# EAGLE design Linetrackerboard_v2 (EAGLE 9.6.2)
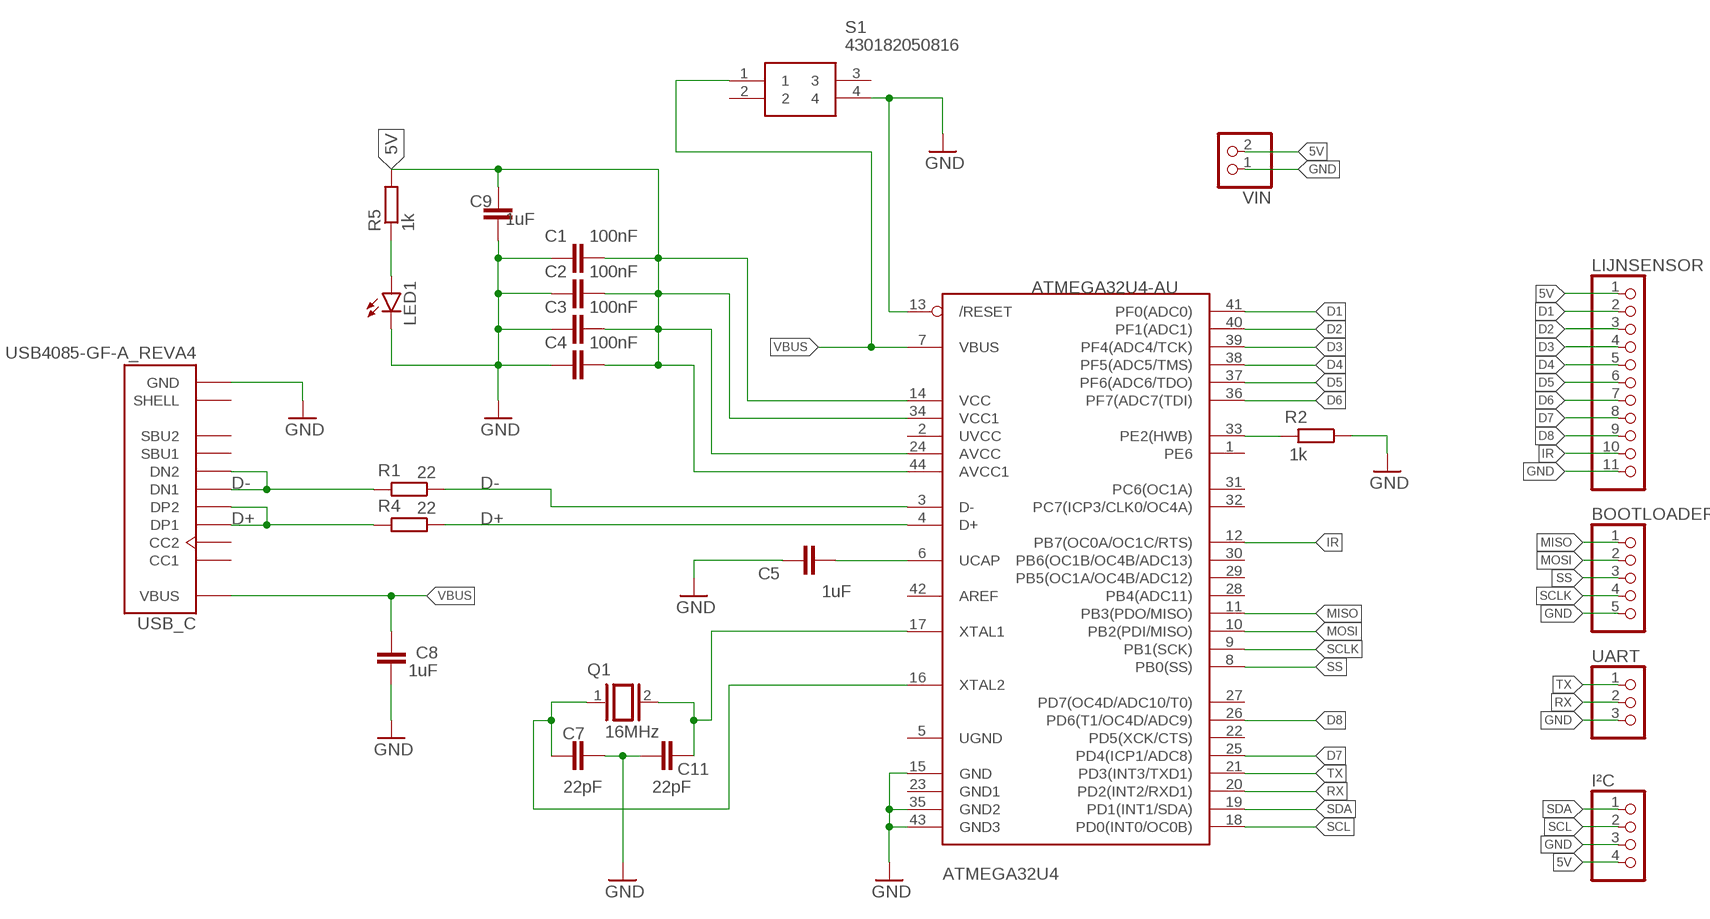
[diagram p0: schematic, sheet 1]

## Parts
ATMEGA32U4  ATMEGA32U4-AU  [TQFP44]
BOOTLOADER  PINHD-1X5  [1X05]
C1  100nF  C-EUC0805  [C0805]
C2  100nF  C-EUC0805  [C0805]
C3  100nF  C-EUC0805  [C0805]
C4  100nF  C-EUC0805  [C0805]
C5  1uF  C-EUC0805  [C0805]
C7  22pF  C-EUC0805  [C0805]
C8  1uF  C-EUC0603  [C0603]
C9  1uF  C-EUC0603  [C0603]
C11  22pF  C-EUC0805  [C0805]
I²C  PINHD-1X4  [1X04]
LED1  LED  [SMARTLED-TTW]
LIJNSENSOR  PINHD-1X11  [1X11]
Q1  16MHz  XTAL/S  [QS]
R1  22  R-EU_M0805  [M0805]
R2  1k  R-EU_M0805  [M0805]
R4  22  R-EU_M0805  [M0805]
R5  1k  R-EU_M0805  [M0805]
S1  430182050816  [430182070816]
UART  PINHD-1X3  [1X03]
USB_C  USB4085-GF-A_REVA4  [GCT_USB4085-GF-A_REVA4]
VIN  PINHD-1X2  [1X02]

## Nets
5V: ATMEGA32U4.14(VCC) ATMEGA32U4.24(AVCC) ATMEGA32U4.34(VCC1) ATMEGA32U4.44(AVCC1) C1.2 C2.2 C3.2 C4.2 C9.2 I²C.4 LIJNSENSOR.1 R5.2 VIN.2
D1: ATMEGA32U4.41(PF0(ADC0)) LIJNSENSOR.2
D2: ATMEGA32U4.40(PF1(ADC1)) LIJNSENSOR.3
D3: ATMEGA32U4.39(PF4(ADC4/TCK)) LIJNSENSOR.4
D4: ATMEGA32U4.38(PF5(ADC5/TMS)) LIJNSENSOR.5
D5: ATMEGA32U4.37(PF6(ADC6/TDO)) LIJNSENSOR.6
D6: ATMEGA32U4.36(PF7(ADC7(TDI)) LIJNSENSOR.7
D7: ATMEGA32U4.25(PD4(ICP1/ADC8)) LIJNSENSOR.8
D8: ATMEGA32U4.26(PD6(T1/OC4D/ADC9)) LIJNSENSOR.9
D+: ATMEGA32U4.4(D+) R4.1 R4.2 USB_C.A6(DP1) USB_C.B6(DP2)
D-: ATMEGA32U4.3(D-) R1.1 R1.2 USB_C.A7(DN1) USB_C.B7(DN2)
GND: ATMEGA32U4.13(/RESET) ATMEGA32U4.15(GND) ATMEGA32U4.35(GND2) ATMEGA32U4.43(GND3) BOOTLOADER.5 C1.1 C2.1 C3.1 C4.1 C5.1 C7.2 C8.2 C9.1 C11.1 I²C.3 LED1.C@1(C) LIJNSENSOR.11 R2.1 S1.4 UART.3 USB_C.A1(GND) USB_C.A12(GND) USB_C.B1(GND) USB_C.B12(GND) VIN.1
IR: ATMEGA32U4.12(PB7(OC0A/OC1C/RTS)) LIJNSENSOR.10
MISO: ATMEGA32U4.11(PB3(PDO/MISO)) BOOTLOADER.1
MOSI: ATMEGA32U4.10(PB2(PDI/MISO)) BOOTLOADER.2
N$4: LED1.A@1(A) R5.1
PE2: ATMEGA32U4.33(PE2(HWB)) R2.2
RX: ATMEGA32U4.20(PD2(INT2/RXD1)) UART.2
SCL: ATMEGA32U4.18(PD0(INT0/OC0B)) I²C.2
SCLK: ATMEGA32U4.9(PB1(SCK)) BOOTLOADER.4
SDA: ATMEGA32U4.19(PD1(INT1/SDA)) I²C.1
SS: ATMEGA32U4.8(PB0(SS)) BOOTLOADER.3
TX: ATMEGA32U4.21(PD3(INT3/TXD1)) UART.1
UCAP: ATMEGA32U4.6(UCAP) C5.2
VBUS: ATMEGA32U4.7(VBUS) C8.1 S1.1 USB_C.A4(VBUS) USB_C.A9(VBUS) USB_C.B4(VBUS) USB_C.B9(VBUS)
XTAL1: ATMEGA32U4.17(XTAL1) C11.2 Q1.2
XTAL2: ATMEGA32U4.16(XTAL2) C7.1 Q1.1
Unconnected: ATMEGA32U4.1(PE6) ATMEGA32U4.2(UVCC) ATMEGA32U4.5(UGND) ATMEGA32U4.22(PD5(XCK/CTS)) ATMEGA32U4.23(GND1) ATMEGA32U4.27(PD7(OC4D/ADC10/T0)) ATMEGA32U4.28(PB4(ADC11)) ATMEGA32U4.29(PB5(OC1A/OC4B/ADC12)) ATMEGA32U4.30(PB6(OC1B/OC4B/ADC13)) ATMEGA32U4.31(PC6(OC1A)) ATMEGA32U4.32(PC7(ICP3/CLK0/OC4A)) ATMEGA32U4.42(AREF) S1.2 S1.3 USB_C.A5(CC1) USB_C.A8(SBU1) USB_C.B5(CC2) USB_C.B8(SBU2) USB_C.P1(SHELL) USB_C.P2(SHELL) USB_C.P3(SHELL) USB_C.P4(SHELL)

## Library data of the parts
ATMEGA32U4 = adaprog:ATMEGA32U4
BOOTLOADER = pinhead:PINHD-1X5: PIN HEADER
C1-C5 C7-C9 C11 = rcl:C-EU: CAPACITOR, European symbol; SPICEPREFIX: C
I²C = pinhead:PINHD-1X4: PIN HEADER
LED1 = led:LED: LED OSRAM: - CHIPLED LG R971, LG N971, LY N971, LG Q971, LY Q971, LO R971, LY R971 LH N974, LH R974 LS Q976, LO Q976, LY Q976 LO Q996 - Hyper CHIPLED LW Q18S LB Q993, LB Q99A, LB R99A - SideLED LS A670, LO A670, LY A670, LG A670, LP A670 LB A673, LV A673, LT A673, LW A673 LH A674 LY A675 LS A676, LA A676, LO A676, LY A676, LW A676 LS A679, LY A679, LG A679 - Hyper Micro SIDELED® LS Y876, LA Y876, LO Y876, LY Y876 LT Y87S - SmartLED LW L88C, LW L88S LB L89C, LB L89S, LG L890 LS L89K, LO L89K, LY L89K LS L896, LA L896, LO L896, LY L896 - TOPLED LS T670, LO T670, LY T670, LG T670, LP T670 LSG T670, LSP T670, LSY T670, LOP T670, LYG T670 LG T671, LOG T671, LSG T671 LB T673, LV T673, LT T673, LW T673 LH T674 LS T676, LA T676, LO T676, LY T676, LB T676, LH T676, LSB T676, LW T676 LB T67C, LV T67C, LT T67C, LS T67K, LO T67K, LY T67K, LW E67C LS E67B, LA E67B, LO E67B, LY E67B, LB E67C, LV E67C, LT E67C LW T67C LS T679, LY T679, LG T679 LS T770, LO T770, LY T770, LG T770, LP T770 LB T773, LV T773, LT T773, LW T773 LH T774 LS E675, LA E675, LY E675, LS T675 LS T776, LA T776, LO T776, LY T776, LB T776 LHGB T686 LT T68C, LB T68C - Hyper Mini TOPLED® LB M676 - Mini TOPLED Santana® LG M470 LS M47K, LO M47K, LY M47K Source: http://www.osram.convergy.de LUXEON: - LUMILED® LXK2-PW12-R00, LXK2-PW12-S00, LXK2-PW14-U00, LXK2-PW14-V00 LXK2-PM12-R00, LXK2-PM12-S00, LXK2-PM14-U00 LXK2-PE12-Q00, LXK2-PE12-R00, LXK2-PE12-S00, LXK2-PE14-T00, LXK2-PE14-U00 LXK2-PB12-K00, LXK2-PB12-L00, LXK2-PB12-M00, LXK2-PB14-N00, LXK2-PB14-P00, LXK2-PB14-Q00 LXK2-PR12-L00, LXK2-PR12-M00, LXK2-PR14-Q00, LXK2-PR14-R00 LXK2-PD12-Q00, LXK2-PD12-R00, LXK2-PD12-S00 LXK2-PH12-R00, LXK2-PH12-S00 LXK2-PL12-P00, LXK2-PL12-Q00, LXK2-PL12-R00 Source: www.luxeon.com KINGBRIGHT: KA-3528ASYC Source: www.kingbright.com
LIJNSENSOR = pinhead:PINHD-1X11: PIN HEADER
Q1 = special:XTAL/S: CRYSTAL
R1 R2 R4 R5 = rcl:R-EU_: RESISTOR, European symbol; SPICEPREFIX: R
S1 = push button:430182050816: Black Tactile Tactile Switch, NO 50 mA 1.6mm Surface Mount Source: Datasheet <http://katalog.we-online.de/em/datasheet/4301x2xxx8x6.pdf>; DESCRIPTION: Black Tactile Tactile Switch, NO 50 mA 1.6mm Surface Mount; HEIGHT: mm; MANUFACTURER_NAME: Wurth Elektronik; MANUFACTURER_PART_NUMBER: 430182050816; MOUSER_PART_NUMBER: 710-430182050816; MOUSER_PRICE-STOCK: https://www.mouser.co.uk/ProductDetail/Wurth-Elektronik/430182050816?qs=wr8lucFkNMUyle0jQPgWGw%3D%3D
UART = pinhead:PINHD-1X3: PIN HEADER
USB_C = USB4085-GF-A:USB4085-GF-A_REVA4: USB 2.0 Type C Receptacle Dip Type, PCB Top Mount Check availability <https://pricing.snapeda.com/parts/USB4085-GF-A/Global%20Connector%20Technology/view-part?ref=eda>; AVAILABILITY: In Stock; DESCRIPTION: USB-C (USB TYPE-C) USB 2.0 Receptacle Connector 24 (16+8 Dummy) Position Through Hole, Right Angle, low cost, 3.46mm profile, 16 pin, horizontal, Top mount; MF: Global Connector Technology; MP: USB4085-GF-A; PACKAGE: None; PRICE: None; PURCHASE-URL: https://pricing.snapeda.com/search/part/USB4085-GF-A/?ref=eda
VIN = pinhead:PINHD-1X2: PIN HEADER

## Board
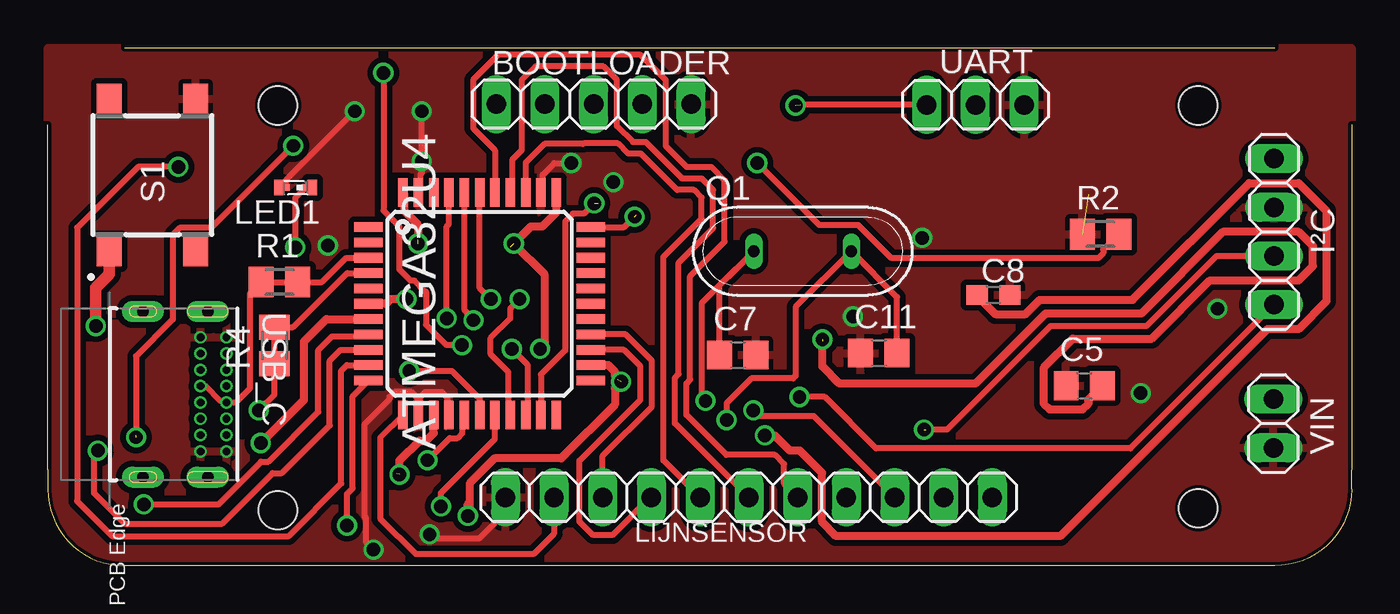
[diagram p1: board, top side]
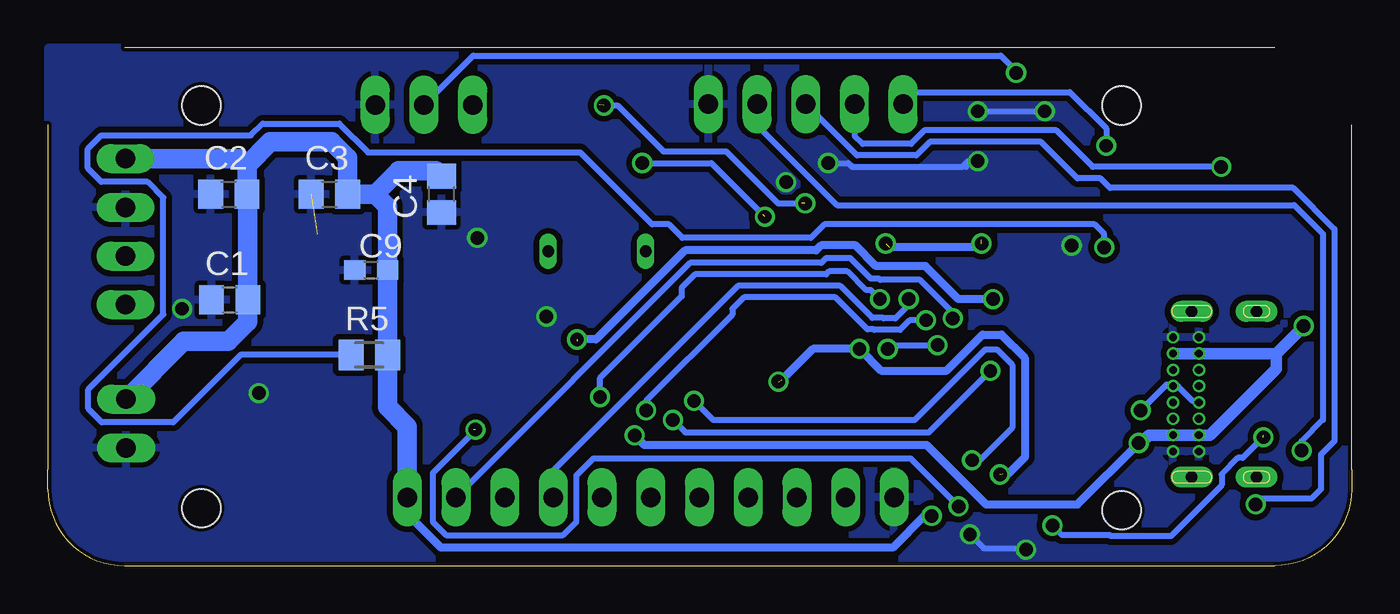
[diagram p2: board, bottom side, seen from below]

Size 68 x 27 mm. Coordinates in mm from the lower left corner, seen from the top.
Outline: 4,27 64,27
Outline: 68,23 68,5 68,4 arc-90 64,0 4,0 arc-90 0,4 0,5 0,23
Copper layers (1*16): Top 0.035mm / dielectric 1.5mm / Bottom 0.035mm
Design rules "default *": minimum track width 0.3mm, minimum drill 0.35mm, track to track 0.3mm, track to pad 0.3mm, pad to pad 0.2mm, via to via 0.3mm, smd to smd 0.2mm, copper to edge 0.2mm, drill to drill 0.3mm, minimum pad ring 0.1mm, minimum via ring 0.1mm, stop-mask expansion 4mil, vias tented up to drill 0mil, thermal gap 10mil
Holes 2 mm at 12,24 60,24 60,3 12,2.9

### Footprints (pad centres in the part's own frame; a part is rotated, then mirrored left to right if it is on the bottom)
TQFP44 = smd 1.5 x 0.5: 1 -5.8,4; 2 -5.8,3.2; 3 -5.8,2.4; 4 -5.8,1.6; 5 -5.8,0.8; 6 -5.8,0; 7 -5.8,-0.8; 8 -5.8,-1.6; 9 -5.8,-2.4; 10 -5.8,-3.2; 11 -5.8,-4; 23 5.8,-4; 24 5.8,-3.2; 25 5.8,-2.4; 26 5.8,-1.6; 27 5.8,-0.8; 28 5.8,0; 29 5.8,0.8; 30 5.8,1.6; 31 5.8,2.4; 32 5.8,3.2; 33 5.8,4 | smd 0.5 x 1.5: 12 -4,-5.8; 13 -3.2,-5.8; 14 -2.4,-5.8; 15 -1.6,-5.8; 16 -0.8,-5.8; 17 0,-5.8; 18 0.8,-5.8; 19 1.6,-5.8; 20 2.4,-5.8; 21 3.2,-5.8; 22 4,-5.8; 34 4,5.8; 35 3.2,5.8; 36 2.4,5.8; 37 1.6,5.8; 38 0.8,5.8; 39 0,5.8; 40 -0.8,5.8; 41 -1.6,5.8; 42 -2.4,5.8; 43 -3.2,5.8; 44 -4,5.8
1X05 = drill 1.016 long: 1 -5.08,0; 2 -2.54,0; 3 0,0; 4 2.54,0; 5 5.08,0
C0805 = smd 1.3 x 1.5: 1 -0.95,0; 2 0.95,0
C0603 = smd 1.1 x 1: 1 -0.85,0; 2 0.85,0
1X04 = drill 1.016 long: 1 -3.81,0; 2 -1.27,0; 3 1.27,0; 4 3.81,0
SMARTLED-TTW = smd 0.8 x 0.5: A 0,-0.875; C 0,0.875 | smd 0.35 x 0.35: A@1 0,-0.5; C@1 0,0.5
1X11 = drill 1.016 long: 1 -12.7,0; 2 -10.16,0; 3 -7.62,0; 4 -5.08,0; 5 -2.54,0; 6 0,0; 7 2.54,0; 8 5.08,0; 9 7.62,0; 10 10.16,0; 11 12.7,0
QS = drill 0.61 long: 1 -2.54,0; 2 2.54,0
M0805 = smd 1.3 x 1.6: 1 -0.95,0; 2 0.95,0
430182070816 = smd 1.55 x 1.3: 1 -3.975,2.25; 2 -3.975,-2.25; 3 3.975,2.25; 4 3.975,-2.25
1X03 = drill 1.016 long: 1 -2.54,0; 2 0,0; 3 2.54,0
GCT_USB4085-GF-A_REVA4 = drill 0.4 pad 0.65: A1 -2.975,4.025; A4 -2.125,4.025; A5 -1.275,4.025; A6 -0.425,4.025; A7 0.425,4.025; A8 1.275,4.025; A9 2.125,4.025; A12 2.975,4.025; B1 2.975,2.675; B4 2.125,2.675; B5 1.275,2.675; B6 0.425,2.675; B7 -0.425,2.675; B8 -1.275,2.675; B9 -2.125,2.675; B12 -2.975,2.675 | drill 0.6 pad 1.108 long: P1 -4.325,3.045; P2 4.325,3.045; P3 4.325,-0.335; P4 -4.325,-0.335
1X02 = drill 1.016 long: 1 -1.27,0; 2 1.27,0

### Placement (x,y rotation side)
ATMEGA32U4  22.52,13.66 0 top
BOOTLOADER  28.47,24.07 0 top
C1  58.52,13.87 0 bottom
C2  58.57,19.37 0 bottom
C3  53.32,19.37 0 bottom
C4  47.47,19.37 90 bottom
C5  54.06,9.39 0 top
C7  35.99,10.99 0 top
C8  49.32,14.12 0 top
C9  51.14,15.42 0 bottom
C11  43.34,11.09 0 top
I²C  63.95,17.42 90 top
LED1  12.93,19.72 90 top
LIJNSENSOR  36.56,3.57 180 top
Q1  39.36,16.4 0 top
R1  12.08,14.79 0 top
R2  54.9,17.29 0 top
R4  11.82,11.49 90 top
R5  51.24,10.99 0 bottom
S1  5.45,20.37 90 top
UART  48.39,24.04 0 top
USB_C  5.29,8.94 270 top
VIN  63.92,7.42 90 top

### Tracks (layer width: path | path; a pad name or v marks a point on that pad's centre or on a via)
5V  (via drill 0.7 pad 0.95)  (4 unrouted)
  Top 0.406: ATMEGA32U4.44 18.57,19.41 18.57,18.5 19.3,17.77 19.3,17 | ATMEGA32U4.34 26.52,18.42 25.8,17.7 25.2,17.7 v24.3,16.8 25.9,15.2 25.9,11.54 v25.67,11.31 | ATMEGA32U4.24 29.23,10.46 29.57,10.12 29.57,9.93 v29.9,9.6 29.57,9.27 29.57,8.4 26.77,5.6 23.3,5.6 22,4.3 22,3.3 | v18.34,4.76 18.34,5.49 19.37,6.53 19.73,6.53 20.12,6.92 ATMEGA32U4.14 | 22,3.3 22,3.1 | v21.9,2.6 21.9,3.2 22,3.3
  Bottom 0.406: v19.3,16.8 19.5,16.6 24.1,16.6 | 29.7,9.7 28.09,11.31 v25.67,11.31 24.54,10.18 21.12,10.18 19.25,12.05 18.25,12.05 17.05,10.84 17.05,5.65 17.9,4.8 18.2,4.8 | v21.9,2.6 22.28,2.6 23.94,0.94 47.49,0.94 49.26,2.71 LIJNSENSOR.1
  Bottom 1.016: VIN.2 60.91,11.7 58.6,11.7 57.57,12.73 C1.2 57.57,19.32 C2.2 57.62,20.88 | 57.62,20.88 56.4,22.1 53.2,22.1 52.37,21.27 C3.2 50.93,19.37 | 50.93,19.37 49.7,20.6 47.75,20.6 C4.2 | 50.93,19.37 50.29,18.73 C9.2 R5.2 50.29,8.29 49.26,7.26 LIJNSENSOR.1 | I²C.4 57.97,21.23 57.62,20.88
D1  (via drill 0.7 pad 0.95)
  Top 0.3: v20.8,12.9 20.8,17.7 20.92,17.82 ATMEGA32U4.41
  Bottom 0.3: v20.8,12.9 20.8,13.2 22.51,14.91 24.6,14.91 24.66,14.97 25.07,14.97 26.14,16.05 27.41,16.05 27.66,15.79 34.5,15.79 LIJNSENSOR.2
D2  (via drill 0.7 pad 0.95)
  Top 0.3: LIJNSENSOR.3 39.95,7.8 37.1,7.8 v36.8,8.1 | v22.2,12.8 22,12.8 21.88,12.93 21.88,13.2 21.72,13.36 ATMEGA32U4.40
  Bottom 0.3: v36.8,8.1 36.8,8.6 32.3,13.1 32.3,13.39 31.7,13.99 26.92,13.99 25.25,12.32 24.93,12.32 24.9,12.3 23.55,12.3 23.05,12.8 v22.2,12.8
D3  (via drill 0.7 pad 0.95)
  Top 0.3: v23.1,13.9 22.52,14.48 ATMEGA32U4.39
  Bottom 0.3: LIJNSENSOR.4 41.64,4.96 32.01,14.59 26.67,14.59 25,12.93 24.43,12.93 24.4,12.9 23.8,12.9 23.1,13.6 v23.1,13.9
D4
  Top 0.3: ATMEGA32U4.38 23.32,21.66 22.18,22.81 22.18,25.33 23.49,26.64 30.91,26.64 32.22,25.33 32.22,21.9 33.32,20.8 34.6,20.8 35.3,20.1 35.3,16.9 33.5,15.1 33.5,9.7 33.3,9.5 33.3,7.87 35.38,5.79 37.91,5.79 38.4,5.3 38.4,4.27 LIJNSENSOR.5
D5
  Top 0.3: LIJNSENSOR.6 32.7,7.43 32.7,9.8 32.9,10 32.9,15.8 34.7,17.6 34.7,19.6 34.1,20.2 33.07,20.2 31.18,22.1 30.51,22.1 29.68,22.92 29.68,25.33 28.97,26.04 25.43,26.04 24.72,25.33 24.72,21.67 24.22,21.17 24.22,19.56 ATMEGA32U4.37
D6
  Top 0.3: LIJNSENSOR.7 32.1,5.49 32.1,16.1 34.1,18.1 34.1,19.2 33.7,19.6 32.83,19.6 30.93,21.5 30.26,21.5 29.73,22.03 27.93,22.03 27.9,22 25.9,22 24.92,21.02 ATMEGA32U4.36
D7
  Top 0.3: LIJNSENSOR.8 31.42,3.57 29.44,1.6 28.44,1.6 27.73,2.31 27.73,5.48 30.9,8.65 30.9,10.4 30.04,11.26 ATMEGA32U4.25
D8
  Top 0.3: LIJNSENSOR.9 28.94,5.74 31.5,8.3 31.5,10.7 30.14,12.06 ATMEGA32U4.26
D+  (via drill 0.7 pad 0.95)
  Top 0.3: R4.2 11.82,8.92 v11,8.1 | R4.1 R4.2 | R4.2 12.79,12.44 15.61,15.26 ATMEGA32U4.4
  Bottom 0.3: USB_C.B6 8.04,8.59 8.29,8.59 9.06,9.37 USB_C.A6 9.39,9.44 9.66,9.44 v11,8.1
D-
  Top 0.3: USB_C.B7 8.22,9.37 8.99,8.59 9.24,8.59 USB_C.A7 9.81,8.52 10.53,9.23 10.53,14.19 R1.1 R1.2 14.29,14.79 15.56,16.06 ATMEGA32U4.3
GND  (via drill 0.7 pad 0.95)  (1 unrouted)
  Top 0.3: LED1.C@1 12.43,20.13 v16,23.7 | ATMEGA32U4.15 20.82,7.96 20.82,8.8 20.56,9.06 19.68,9.06 19.42,8.8 19.42,7.96 ATMEGA32U4.13 19.32,8.71 19.14,8.89 | 19,9.03 19.14,8.89 | 19.14,8.89 19.12,8.89 18.96,9.06 18.08,9.06 17.82,8.8 17.82,8.67 16.5,7.35 16.5,2.58 16.57,2.5 16.57,1.25 v16.98,0.84 | LIJNSENSOR.11 23.86,2.8 22.48,1.42 19.89,1.42 19.77,1.54 | ATMEGA32U4.35 25.82,19.56 25.82,20.4 26.42,21 v27.3,21 | ATMEGA32U4.43 19.42,19.56 19.42,20.4 19.5,20.48 v19.5,21.1 v19.5,23.7
  Bottom 0.3: v19.5,23.7 v16,23.7 | v19.91,1.64 19.18,0.91 17.13,0.91 | v27.3,21 26.25,21 26.05,20.8 20.3,20.8 | 20.1,20.8 20.3,20.8 | 20.3,20.8 20,21.1 v19.5,21.1
  other vias: 57,9 42,13 14.6,16.7 29.5,20 45.6,17.1 61,13.4
  pour Top: 0,27 68,27 68,0 0,0
  pour Bottom: 0,27 68,27 68,0 0,0
IR
  Top 0.3: LIJNSENSOR.10 26.4,1.67 25.33,0.6 19.2,0.6 17.34,2.46 17.34,6.68 ATMEGA32U4.12
MISO  (via drill 0.7 pad 0.95)  (1 unrouted)
  Top 0.3: v12.8,21.9 8.52,17.62 6.86,17.62 6.51,17.27 6.51,12.85 4.6,10.94 4.6,6.8 | v15.6,2.1 15.6,3.74 15.9,4.04 15.9,8.84 ATMEGA32U4.11
  Bottom 0.3: BOOTLOADER.1 22.76,24.7 14.7,24.7 12.8,22.8 v12.8,21.9 | v4.6,6.7 5.68,5.62 5.92,5.62 6.78,4.77 6.78,4.2 9.43,1.55 12.56,1.55 12.61,1.6 15.1,1.6 v15.6,2.1
MOSI  (via drill 0.7 pad 0.95)
  Top 0.3: v6.8,20.8 4.7,20.8 1.52,17.62 1.52,3.38 3.35,1.55 12.56,1.55 15.3,4.29 15.3,10.18 15.58,10.46 ATMEGA32U4.10
  Bottom 0.3: v6.8,20.8 13.5,20.8 15.4,22.7 22.28,22.7 22.98,22 25.5,22 25.93,22.43 BOOTLOADER.2
N$4  (via drill 0.7 pad 0.95)
  Top 0.3: LED1.A@1 12.9,19.19 v12.9,16.6
  Bottom 0.3: R5.1 57.95,10.99 61.47,7.48 65.18,7.48 65.89,8.19 65.89,9.19 65.18,9.9 61.98,13.11 61.98,19.19 62.8,20.02 65.21,20.02 65.92,20.73 65.92,21.73 65.21,22.44 57.41,22.44 56.8,23.06 52.8,23.06 51.3,21.56 40.24,21.56 36.48,17.8 35.6,17.8 34.9,17.1 28.2,17.1 27.5,17.8 13.4,17.8 12.9,17.3 v12.9,16.6
PE2  (via drill 0.7 pad 0.95)  (1 unrouted)
  Top 0.3: R2.2 55.05,16.49 55.05,16.3 54.79,16.04 44,16.04 42.28,17.76 40.24,17.76 v37,21 | ATMEGA32U4.33 30.06,17.66 v30.6,18.2
  Bottom 0.3: v37,21 33.4,21 30.7,18.3
RX  (via drill 0.7 pad 0.95)
  Top 0.305: v17.5,25.7 17.5,18.52 18.32,17.7 18.32,15.46 18.9,14.88 19.11,14.88 19.68,14.3 19.72,14.3 19.72,12.58 20.8,11.5 v21.6,11.5 | v24.2,11.3 25.02,10.48 25.02,7.96 ATMEGA32U4.20
  Bottom 0.3: UART.2 45.82,26.6 18.3,26.6 | v17.5,25.7 17.5,25.8 17.65,25.95
  Bottom 0.305: 18.3,26.6 17.65,25.95 | v21.6,11.5 24,11.5 v24.2,11.3
SCL  (via drill 0.7 pad 0.95)  (1 unrouted)
  Top 0.3: I²C.2 60.95,16.15 57.3,12.5 52.3,12.5 46.9,7.1 45.8,7.1 | v20.5,3.1 20.5,3.8 23.32,6.62 ATMEGA32U4.18
  Bottom 0.3: v45.7,7.1 45.7,7.07 47.93,4.83 47.93,2.31 47.22,1.6 41.14,1.6 40.43,2.31 40.43,4.72 39.55,5.6 23,5.6 v20.5,3.1
SCLK  (via drill 0.7 pad 0.95)
  Top 0.3: v2.6,6 2.4,5.8 2.4,3.8 4,2.2 9.09,2.2 11.72,4.83 12.2,4.83 14.7,7.32 14.7,10.7 15.26,11.26 ATMEGA32U4.9
  Bottom 0.3: BOOTLOADER.4 31.01,22.97 26.84,18.8 3,18.8 1.5,17.3 1.5,7.6 2.6,6.5 v2.6,6
SDA  (via drill 0.7 pad 0.95)
  Top 0.3: I²C.1 56.47,6.12 43.2,6.12 40.52,8.8 v39.2,8.8 | v24.6,13.9 24.12,13.42 24.12,12.9 23.1,11.88 23.1,11.02 24.02,10.1 24.02,7.96 ATMEGA32U4.19
  Bottom 0.3: v39.2,8.8 39.2,9.8 34.95,14.05 34.95,14.49 34.25,15.19 27.41,15.19 27.25,15.35 26.3,15.35 25.32,14.38 25.07,14.38 v24.6,13.9
SS  (via drill 0.7 pad 0.95)
  Top 0.3: ATMEGA32U4.8 16.62,11.96 14.81,11.96 14.1,11.25 14.1,8.02 11.5,5.42 11.12,5.42 8.89,3.2 v5,3.2
  Bottom 0.3: v5,3.2 4.7,3.5 2.1,3.5 1.6,4 1.6,5.8 0.9,6.5 0.9,17.55 3.05,19.7 12.6,19.7 13.1,20.2 14.3,20.2 16.2,22.1 22,22.1 22.7,21.4 25.8,21.4 BOOTLOADER.3
TX  (via drill 0.7 pad 0.95)  (2 unrouted)
  Top 0.3: UART.1 39.27,24.04 | v28.5,18.9 27.96,18.36 27.38,18.36 26.98,17.95 26.98,11.24 25.72,9.98 ATMEGA32U4.21
  Bottom 0.3: v39,24 38.3,24 35.9,21.6 32.62,21.6 29.92,18.9 28.7,18.9
UCAP  (via drill 0.7 pad 0.95)  (1 unrouted)
  Top 0.406: C5.2 54.26,8.64 54.26,8.43 53.97,8.14 52.25,8.14 51.96,8.43 51.96,10.35 53.45,11.85 57.57,11.85 60.61,14.88 65.24,14.88 65.98,15.63 65.98,16.67 65.24,17.41 61.29,17.41 57.03,13.15 52.03,13.15 48.38,9.5 41.3,9.5 40.4,10.4 40.4,11.7 | v18.7,13.9 17.87,13.9 17.63,13.66 ATMEGA32U4.6
  Bottom 0.406: v40.4,11.8 39.41,11.8 34.77,16.45 27.93,16.45 27.68,16.7 25.87,16.7 24.8,15.63 22.23,15.63 20.5,13.9 v18.7,13.9
VBUS  (via drill 0.7 pad 0.95)
  Top 0.406: v11.1,6.4 13.35,8.65 13.35,11.7 14.51,12.86 ATMEGA32U4.7 | C8.1 48.47,14.06 49.41,13.12 50.99,13.12 51.74,13.86 56.57,13.86 62.66,19.95 65.24,19.95 66.68,18.51 66.68,13.79 65.24,12.35 63.61,12.35 52.81,1.54 41.12,1.54 40.38,2.28 40.38,4.85 39.22,6 38.7,6 37.9,6.8 v37.4,6.8
  Top 0.61: v2.5,12.5 2.5,14.5 3.2,15.2 S1.1
  Bottom 0.406: v37.4,6.8 36.9,6.3 22.17,6.3 19.07,3.2 14.3,3.2 v11.1,6.4
  Bottom 0.61: USB_C.A4 USB_C.B9 3.94,11.06 | 3.94,11.06 v2.5,12.5 | USB_C.A9 USB_C.B4 | USB_C.A9 7.38,6.82 3.94,10.27 3.94,11.06 | USB_C.A9 10.59,6.82 11,6.4 v11.1,6.4
XTAL1  (via drill 0.7 pad 0.95)
  Top 0.3: C11.2 44.29,14.01 Q1.2 39,13.5 39,9.9 38.88,9.78 36.7,9.78 35.4,8.48 v35.4,7.6 | v18.84,10.16 21.06,10.16 22.52,8.7 ATMEGA32U4.17
  Bottom 0.3: v35.4,7.6 34.75,6.95 22.05,6.95 v18.84,10.16
XTAL2  (via drill 0.7 pad 0.95)
  Top 0.3: C7.1 35.04,14.62 Q1.1 34.1,13.68 34.1,8.8 v34.3,8.6 | v19.8,5.5 20.96,6.66 21.36,6.66 21.62,6.92 21.62,7.76 ATMEGA32U4.16
  Bottom 0.3: v34.3,8.6 33.3,7.6 22.78,7.6 19.09,11.29 18.5,11.29 17.7,10.48 17.7,7.2 19.4,5.5 v19.8,5.5